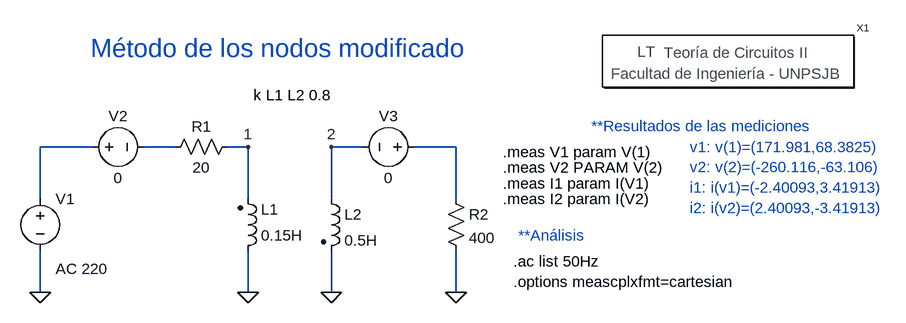
[diagram p0: schematic nodos_modificado.asc]
nodos_modificado.asc, the LTspice schematic file:
Version 4
SHEET 1 1940 1012
WIRE 112 80 32 80
WIRE 240 80 192 80
WIRE 352 80 320 80
WIRE 528 80 480 80
WIRE 672 80 608 80
WIRE 32 160 32 80
WIRE 352 160 352 80
WIRE 480 160 480 80
WIRE 672 160 672 80
WIRE 32 304 32 240
WIRE 352 304 352 240
WIRE 480 304 480 240
WIRE 672 304 672 240
FLAG 32 304 0
FLAG 352 304 0
FLAG 480 304 0
FLAG 672 304 0
FLAG 352 80 1
FLAG 480 80 2
SYMBOL voltage 32 144 R0
WINDOW 123 24 124 Left 2
WINDOW 39 0 0 Left 0
SYMATTR InstName V1
SYMATTR Value ""
SYMATTR Value2 AC 220
SYMBOL voltage 96 80 R270
WINDOW 0 32 56 VTop 2
WINDOW 3 -32 56 VBottom 2
SYMATTR InstName V2
SYMATTR Value 0
SYMBOL res 336 64 R90
WINDOW 0 0 56 VBottom 2
WINDOW 3 32 56 VTop 2
SYMATTR InstName R1
SYMATTR Value 20
SYMBOL ind2 336 256 M180
WINDOW 0 36 80 Left 2
WINDOW 3 36 40 Left 2
SYMATTR InstName L1
SYMATTR Value 0.15H
SYMATTR Type ind
SYMBOL ind2 464 144 R0
SYMATTR InstName L2
SYMATTR Value 0.5H
SYMATTR Type ind
SYMBOL voltage 624 80 R90
WINDOW 0 -32 56 VBottom 2
WINDOW 3 32 56 VTop 2
SYMATTR InstName V3
SYMATTR Value 0
SYMBOL res 656 144 R0
SYMATTR InstName R2
SYMATTR Value 400
SYMBOL Circuitos2\\Letreros\\Teoría\ de\ Circuitos\ II 1088 -48 R0
SYMATTR InstName X1
TEXT 768 216 Left 2 ;**Análisis
TEXT 760 256 Left 2 !.ac list 50Hz
TEXT 760 288 Left 2 !.options meascplxfmt=cartesian
TEXT 400 -72 Center 4 ;Método de los nodos modificado
TEXT 880 48 Left 2 ;**Resultados de las mediciones
TEXT 744 88 Left 2 !.meas V1 param V(1)
TEXT 360 0 Left 2 !k L1 L2 0.8
TEXT 744 112 Left 2 !.meas V2 PARAM V(2)
TEXT 744 136 Left 2 !.meas I1 param I(V1)
TEXT 744 160 Left 2 !.meas I2 param I(V2)
TEXT 1032 80 Left 2 ;v1: v(1)=(171.981,68.3825)\nv2: v(2)=(-260.116,-63.106)\ni1: i(v1)=(-2.40093,3.41913)\ni2: i(v2)=(2.40093,-3.41913)

The netlist it stands for:
* nodos_modificado.asc
V1 N001 0 AC 220
V2 N001 N002 0
R1 1 N002 20
L1 0 1 0.15H
L2 2 0 0.5H
V3 N003 2 0
R2 N003 0 400
XX1 Teoría de Circuitos II
* **Análisis
.ac list 50Hz
.options meascplxfmt=cartesian
* Método de los nodos modificado
* **Resultados de las mediciones
.meas V1 param V(1)
k L1 L2 0.8
.meas V2 PARAM V(2)
.meas I1 param I(V1)
.meas I2 param I(V2)
* v1: v(1)=(171.981,68.3825)
* v2: v(2)=(-260.116,-63.106)
* i1: i(v1)=(-2.40093,3.41913)
* i2: i(v2)=(2.40093,-3.41913)
.backanno
.end